# EasyEDA schematic schematic.json
TITLE: Sheet_1; REV: 1.0; Date: 2025-01-30; Sheet: 1/1; Drawn By: 27tthangavel; Company: Your Company
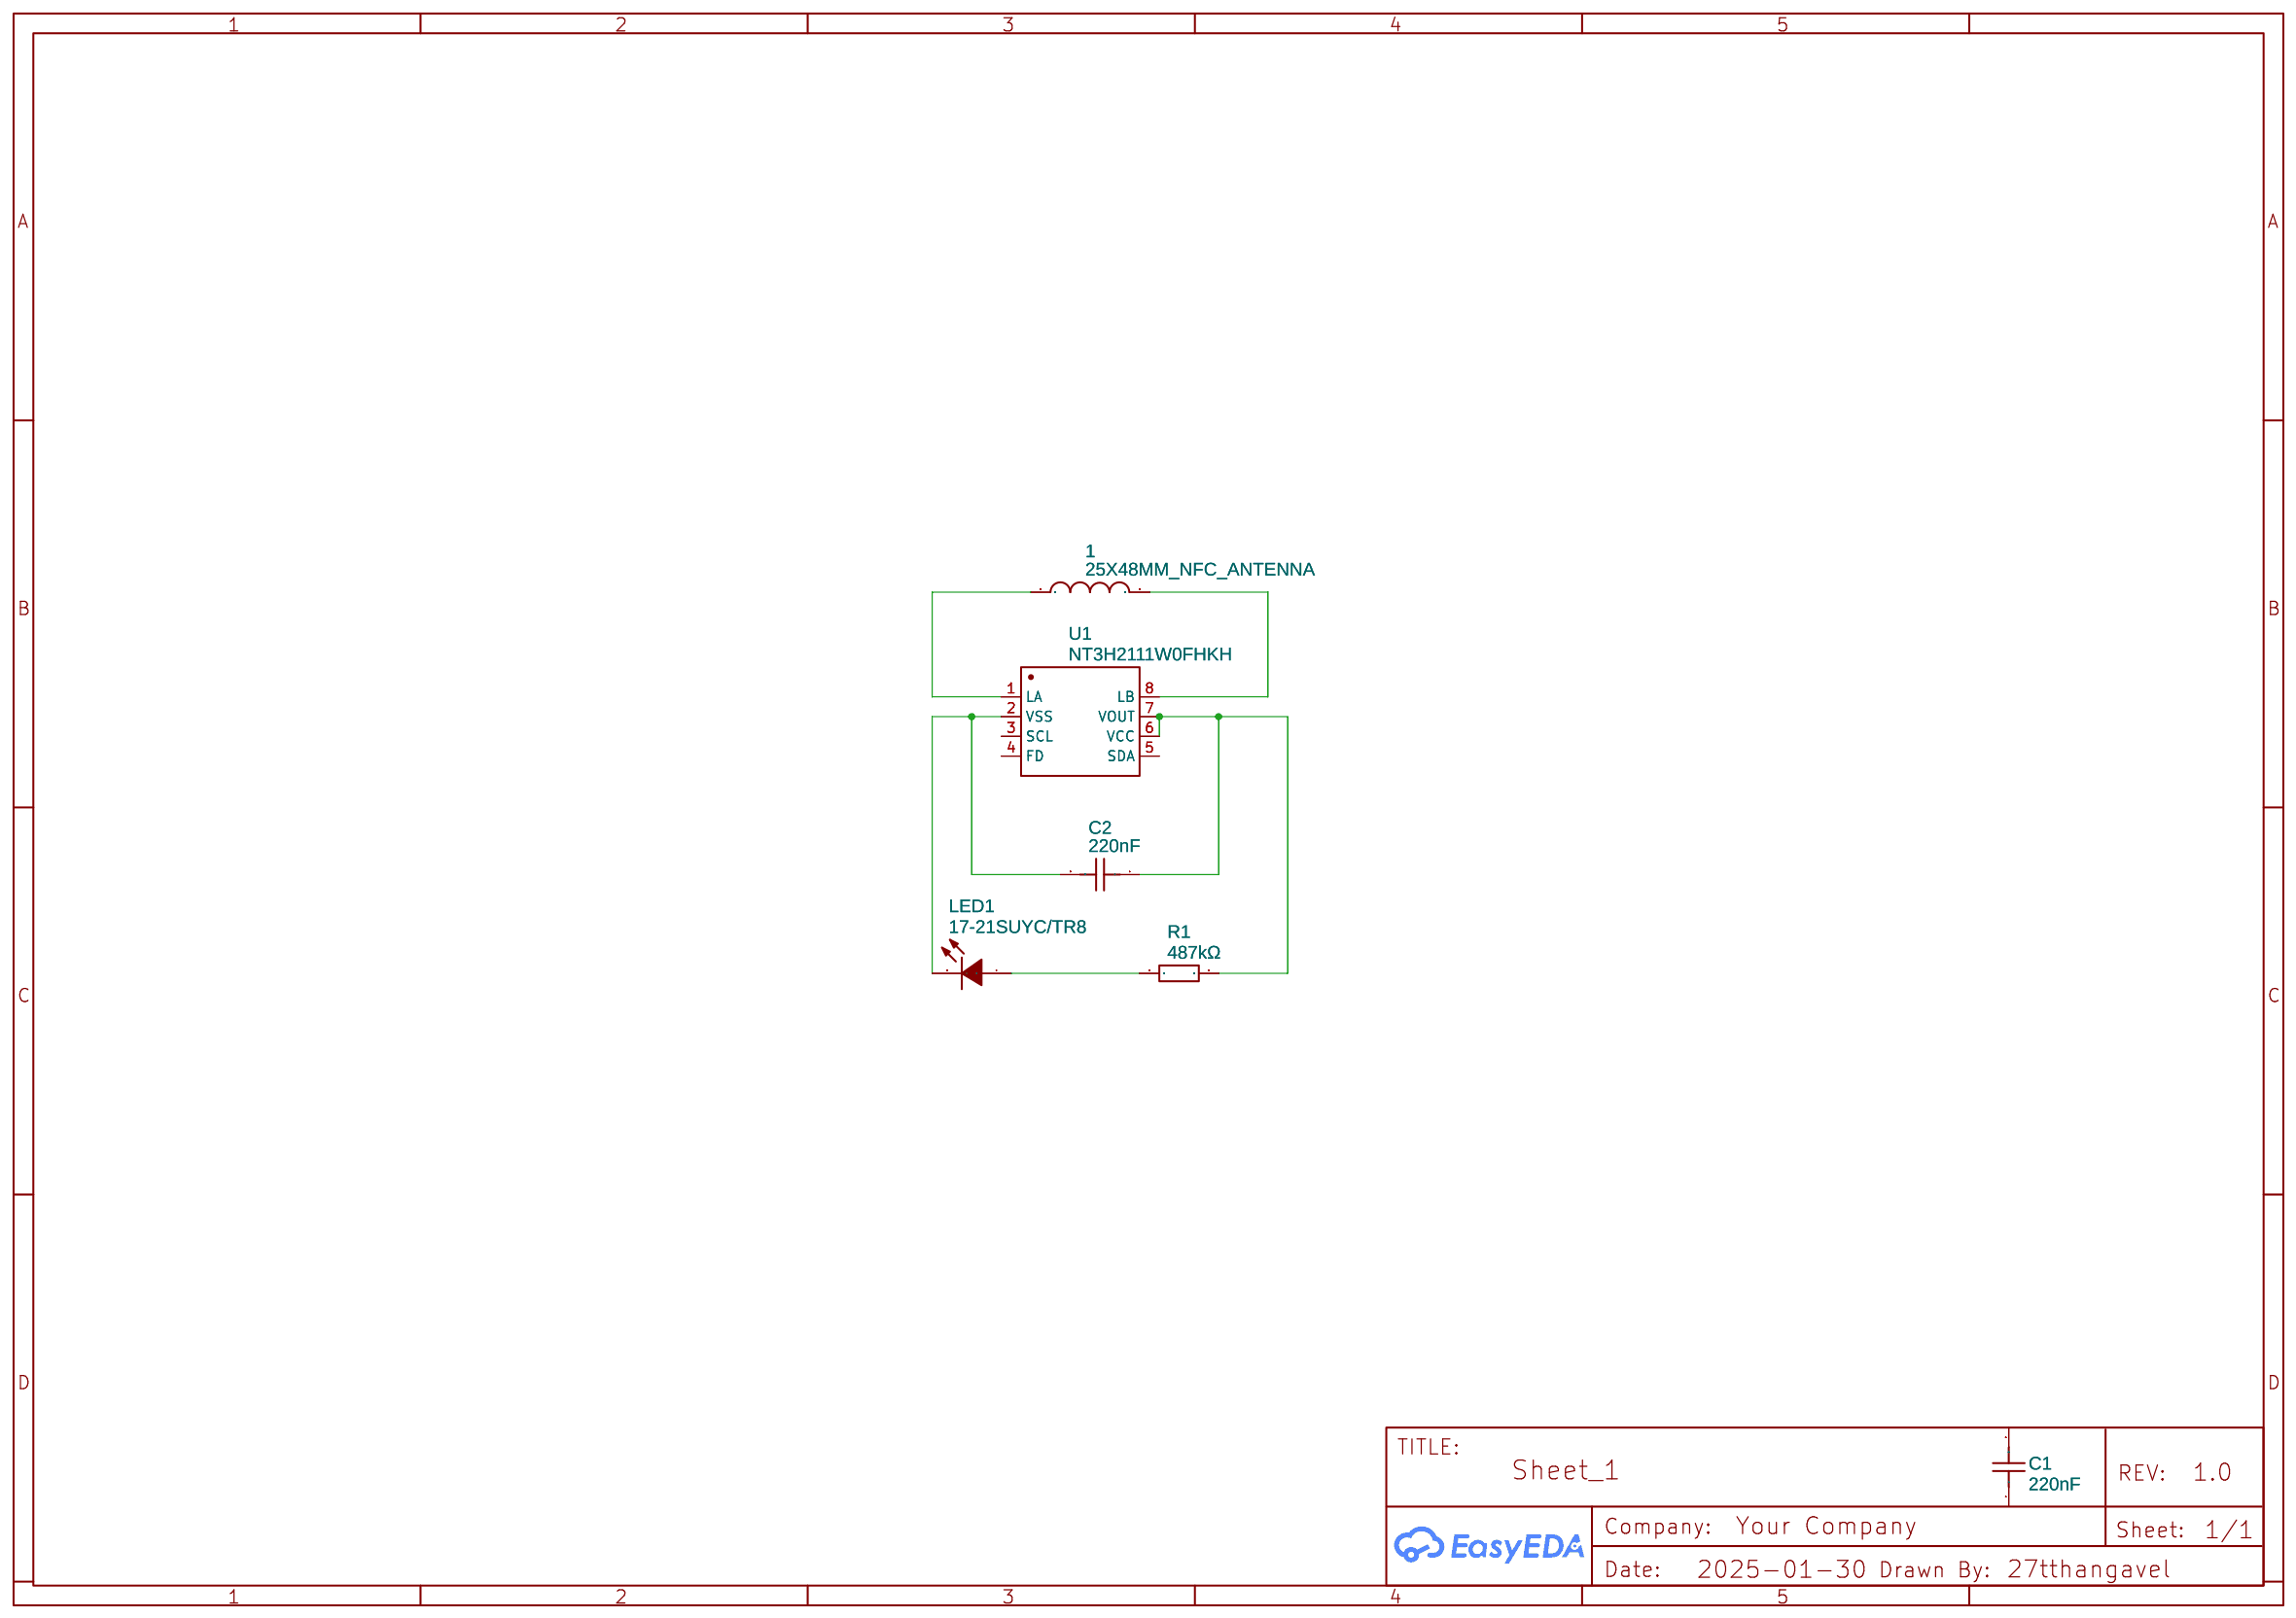
[diagram p0: schematic sheet]

## Parts
1  25X48MM_NFC_ANTENNA  [25X48MM_NFC]
C1  220nF  [C0603]
C2  220nF  [C0603]
LED1  17-21SUYC/TR8  [LED0805-R-RD]
R1  487kΩ  [R0603]
U1  NT3H2111W0FHKH  [XQFN-8_L1.6-W1.6-P0.50-BL_NT3H2111W0FHKH]

## Library data of the parts
1 = 25X48MM_NFC_ANTENNA: Contributor: mertaydin
C1 C2 = CL10B224KA8VPNC: Contributor: LCSC; Supplier: LCSC; Supplier Part: C472764; Manufacturer: SAMSUNG(三星); JLCPCB Part Class: Extended Part
LED1 = 17-21SUYC/TR8: Supplier: LCSC; Manufacturer: KENTO; Manufacturer Part: KT-0805黄灯; Supplier Part: C2296; JLCPCB Part Class: Basic Part
R1 = 0603WAF4873T5E: Supplier: LCSC; Manufacturer: UNI-ROYAL(厚声); Supplier Part: C23183; JLCPCB Part Class: Extended Part
U1 = NT3H2111W0FHKH: Contributor: LCSC; Supplier: LCSC; Supplier Part: C710403; Manufacturer: NXP(恩智浦); JLCPCB Part Class: Extended Part

## Nets
Net-(1-P$1): 1.P$1 U1.1(LA)
Net-(1-P$2): 1.P$2 U1.8(LB)
Net-(C2-1): C2.1 R1.2 U1.6(VCC) U1.7(VOUT)
Net-(C2-2): C2.2 LED1.2(-) U1.2(VSS)
Net-(LED1-1): LED1.1(+) R1.1

Not connected (* = marked no-connect by the designer): C1 1 2; U1 3(SCL) 4(FD) 5(SDA)
